# Altium schematic sheet led_control.SchDoc
size Letter; CompanyName: Carnegie Mellon University; Organization: Carnegie Mellon University; Address1: Carnegie Mellon University; Address2: Robotics Institute; Address3: 5000 Forbes Ave., 4208 NSH; Address4: Pittsburgh, PA 15213; DocumentNumber: 5; Revision: 1.0; SheetNumber: 5; SheetTotal: 8; PageSetup: Record=PageOptions|CenterHorizontal=True|CenterVertical=True|PrintScale=1.00|XCorrection=1.00|YCorrection=1.00|PrintKind=0|BorderSize=5000000|LeftOffset=0|BottomOffset=0|Orientation=2|PaperLength=1000|PaperWidth=1000|Scale=100|PaperSource=7|PrintQuality=-4|MediaType=1|DitherType=10|PaperKind=Letter|PrintScaleMode=1
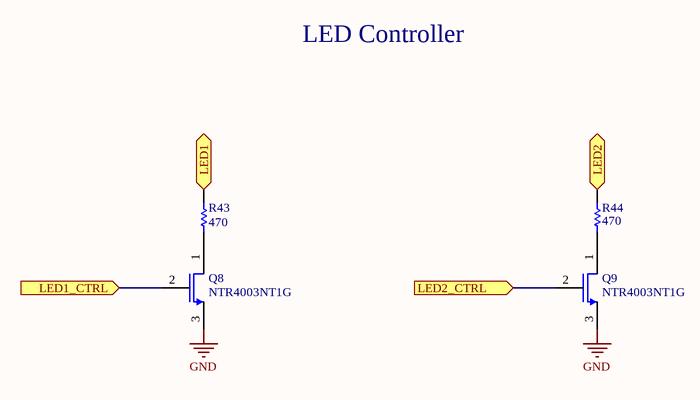
[diagram p0: led_control.SchDoc]

## Parts
Q8  NTR4003NT1G  [SOT-23]
Q9  NTR4003NT1G  [SOT-23]
R43  470  [RESC1608N]
R44  470  [RESC1608N]

## Ports
LED1 (in), LED1_CTRL (in), LED2 (in), LED2_CTRL (in)

## Nets
GND: Q8.3 Q9.3
LED1: R43.1 ; port LED1
LED1_CTRL: Q8.2 ; port LED1_CTRL
LED2: R44.2 ; port LED2
LED2_CTRL: Q9.2 ; port LED2_CTRL
NetQ8_1: Q8.1 R43.2
NetQ9_1: Q9.1 R44.1

## Notes on the sheet
- LED Controller
- Title
- Size:
- Date:
- Letter
- Number:
- Time:
- Revision:
- Sheet
- of
- File:

## Library data of the parts
Q8 Q9 = NTR4003NT1G: N-Channel MOSFET; pin to pad: 1>3 2>1 3>2; Manufacturer: ON Semiconductor; Description: MOSFET N-CH 30V 500MA SOT-23; FET Type: MOSFET N-Channel, Metal Oxide; FET Feature: Standard; Drain to Source Voltage (Vdss): 30V; Current - Continuous Drain (Id) @ 25°C: 500mA (Ta); Rds On (Max) @ Id, Vgs: 1.5 Ohm @ 10mA, 4V; Vgs(th) (Max) @ Id: 1.4V @ 250µA; Gate Charge (Qg) @ Vgs: 1.15nC @ 5V; Input Capacitance (Ciss) @ Vds: 21pF @ 5V; Power - Max: 690mW; Supplier 1: Digi-Key; Supplier Part Number 1: NTR4003NT1GOSCT-ND; Manufacturer Part Number: NTR4003NT1G; RoHS: RoHS Compliant; Category: Discrete Semiconductor Products; Stock 1: 65978; Pricing 1: 1=0.27, 10=0.223, 100=0.118, 500=0.07758, 1000=0.05286 (USD); Packaging: Cut Tape (CT); Operating Temperature: -55°C ~ 150°C (TJ); Mounting Type: Surface Mount; Package / Case: TO-236-3, SC-59, SOT-23-3; Supplier Device Package: SOT-23-3 (TO-236); ComponentLink1URL: http://www.onsemi.com/pub_link/Collateral/NTR4003N-D.PDF; ComponentLink1Description: http://www.onsemi.com/pub_link/Collateral/NTR4003N-D.PDF
R43 R44 = Res1: Resistor; Manufacturer: Yageo; Manufacturer Part Number: RC0603JR-07470RL; Description: RES SMD 470 OHM 5% 1/10W 0603; Tolerance: ±5%; Power (Watts): 0.1W, 1/10W; Temperature Coefficient: ±100ppm/°C; Published: 8-Jun-2000; LatestRevisionDate: 17-Jul-2002; LatestRevisionNote: Re-released for DXP Platform.; PackageReference: AXIAL-0.3; Publisher: Altium Limited; PackageDescription: Axial Device, Thru-Hole; 2 Leads; 0.3 in Pin Spacing; Value: 470; Supplier 1: Digi-Key; Supplier Part Number 1: 311-470GRCT-ND; RoHS: RoHS Compliant; Category: Resistors; Stock 1: 674624; Pricing 1: 1=0.1, 10=0.011, 25=0.008, 100=0.0044, 250=0.00336, 500=0.0027, 1000=0.00198, 2500=0.00172 (USD); Packaging: Cut Tape (CT); Resistance (Ohms): 470; Composition: Thick Film; Features: Moisture Resistant; Operating Temperature: -55°C ~ 155°C; Package / Case: 0603 (1608 Metric); Supplier Device Package: 0603; Size / Dimension: 0.063" L x 0.031" W (1.60mm x 0.80mm); Height: 0.022" (0.55mm); Number of Terminations: 2; ComponentLink1URL: http://www.yageo.com/documents/recent/PYu-RC_Group_51_RoHS_L_04.pdf; ComponentLink1Description: http://www.yageo.com/documents/recent/PYu-RC_Group_51_RoHS_L_04.pdf